# EAGLE board vr61-revC (EAGLE 9.6.2), part 1 of 2
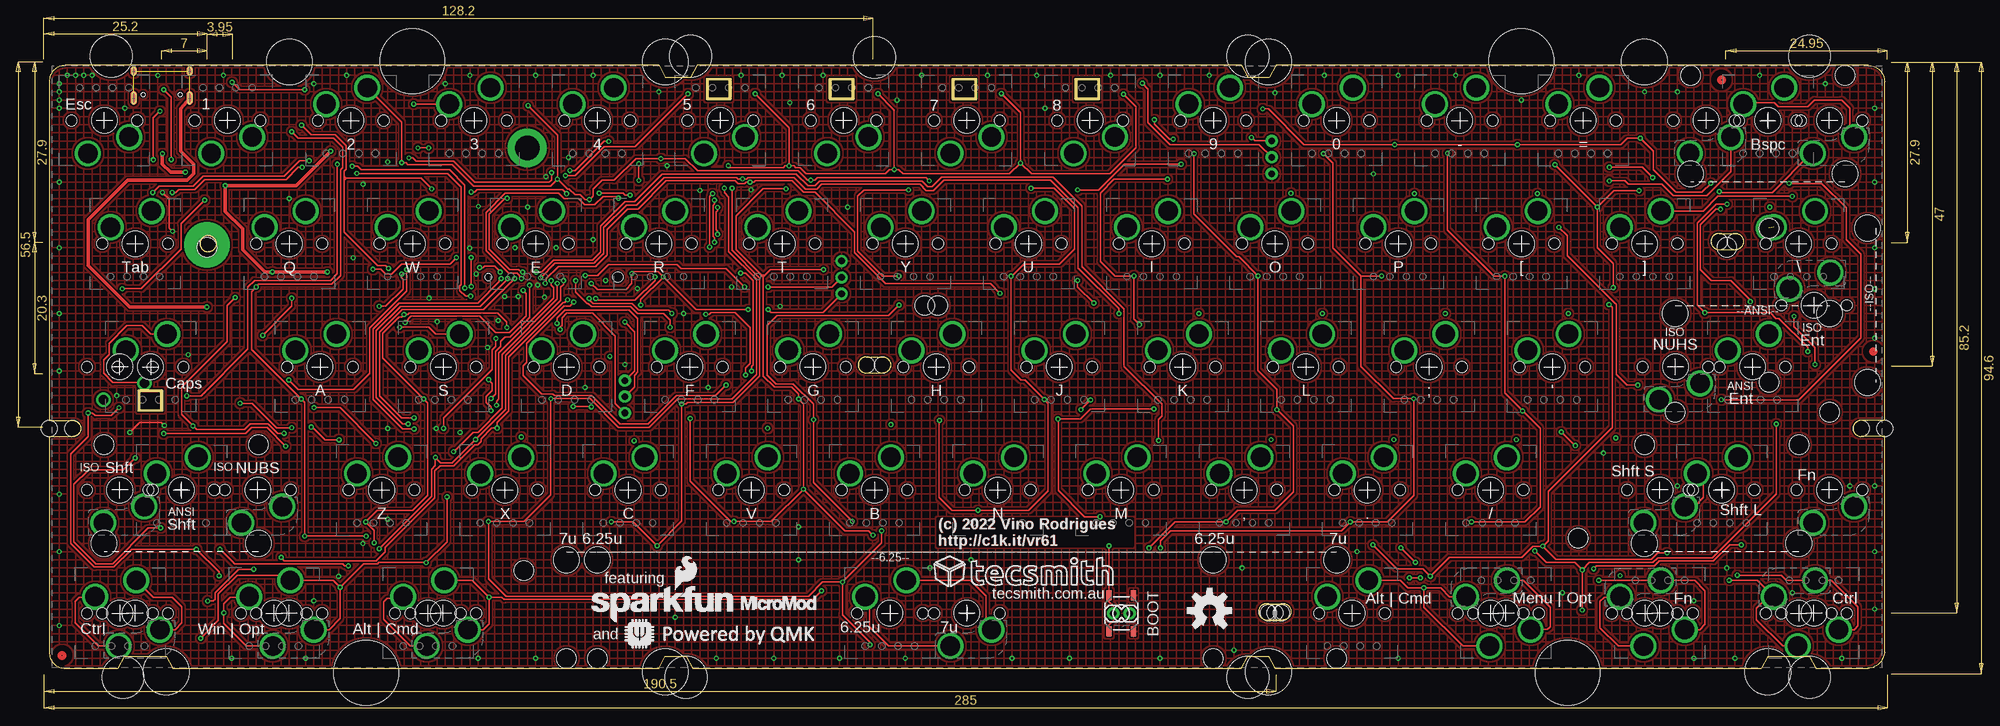
[diagram p2: board, top side]
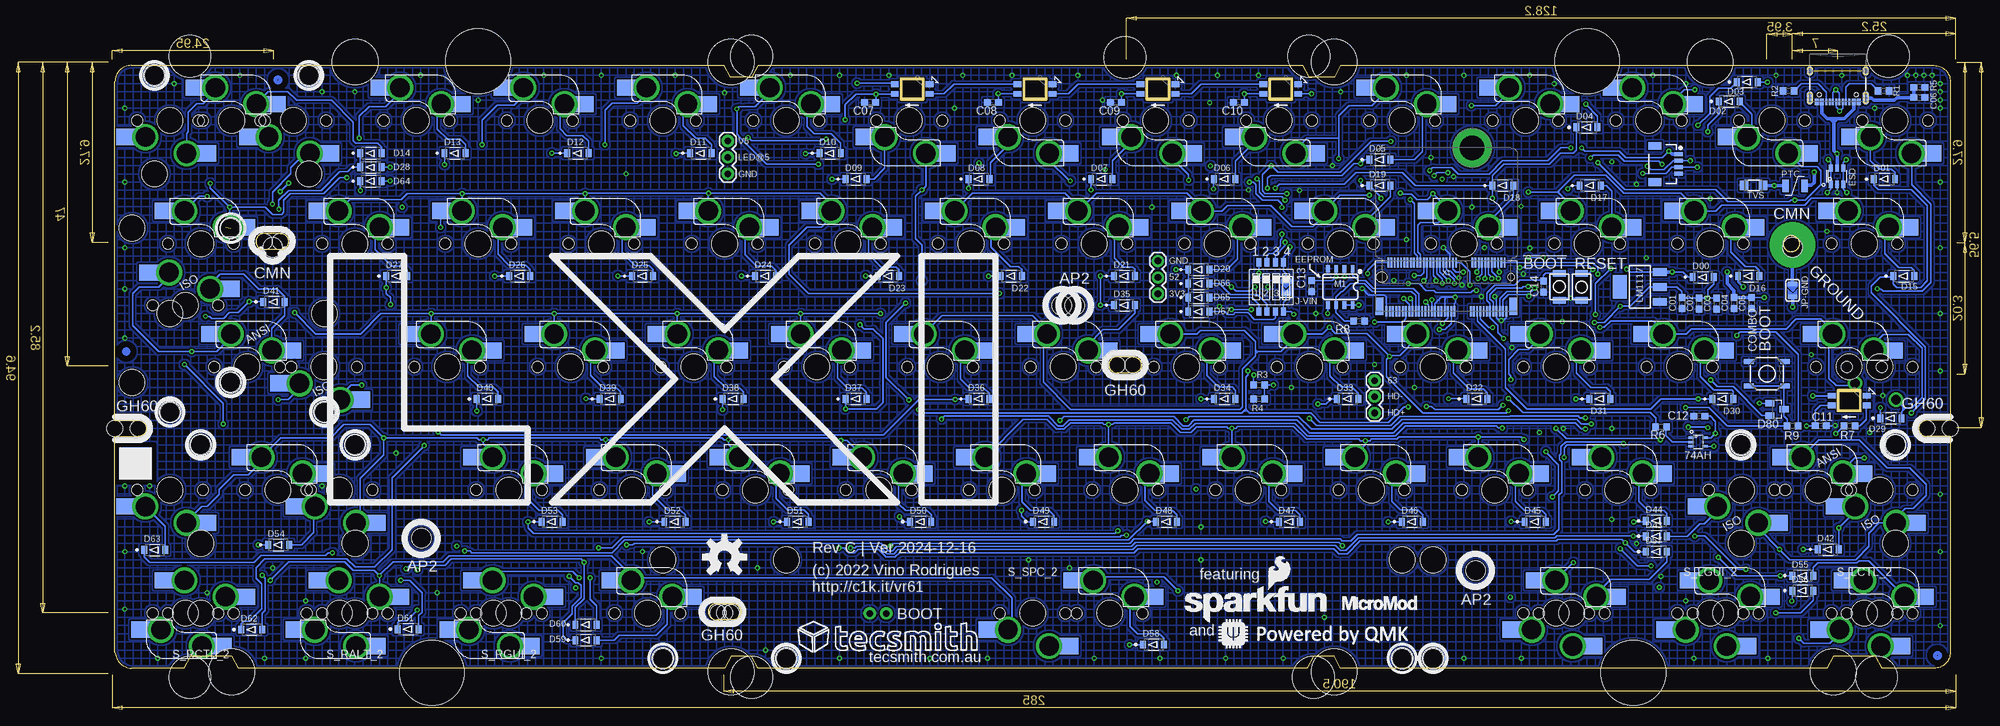
[diagram p3: board, bottom side, seen from below]

Size 304.13 x 107.25 mm. Coordinates in mm from the lower left corner, seen from the top.
Outline: 286.07,42.55 285.95,42.55
Outline: 131.41,54.55 arc180 131.46,52.05 133.95,52.05 arc180 133.94,54.55 131.41,54.55
Copper layers (1*16): Top 0.035mm / dielectric 1.5mm / Bottom 0.035mm
Design rules "jlcpcb *": minimum track width 5mil, minimum drill 0.3mm, track to track 9.5mil, track to pad 9.5mil, pad to pad 9.5mil, via to via 9.5mil, smd to smd 9.5mil, copper to edge 0.2mm, drill to drill 6mil, minimum pad ring 3mil, minimum via ring 8mil, stop-mask expansion 0mil, vias tented up to drill 15mil, thermal gap 10mil
Net classes: 0 default: width 0 mm, drill 0 mm
Holes 2.5 mm at 194.61,14.98 193.61,14.98 195.61,14.98

## Footprints (pad centres in the part's own frame; a part is rotated, then mirrored left to right if it is on the bottom)
SC-88A__TSSOP5__SOT353-1 = smd 0.375 x 0.825: 1 -0.65,-1.087; 2 0,-1.087; 3 0.65,-1.087; 4 0.65,1.087; 6 -0.65,1.087
0603 = smd 1.1 x 1: 1 -0.85,0; 2 0.85,0
C0603 = smd 1.1 x 1: 1 -0.85,0; 2 0.85,0
SOD-123 = smd 0.914 x 1.219: A 1.638,0; C -1.638,0
SOT23 = smd 1 x 1.4: 1 -0.95,-1.1; 2 0.95,-1.1; 3 0,1.1
DIP-1.27-004 = smd 0.76 x 1.27: 1 -1.905,-3.81; 2 -0.635,-3.81; 3 0.635,-3.81; 4 1.905,-3.81; 5 1.905,3.81; 6 0.635,3.81; 7 -0.635,3.81; 8 -1.905,3.81
SOT-23-6L = smd 0.6 x 1.1: P$1 -0.95,-1.25; P$2 0,-1.25; P$3 0.95,-1.25; P$4 0.95,1.25; P$5 0,1.25; P$6 -0.95,1.25
FOOTPRINT-AP2 = hole 3: 24,65; 73,15; 137,56; 236,20; 259,65; 135,56
STAND-OFF-REFLOW-M2.5 = drill 3.8 pad 6: 1 0,0
1X03 = drill 1.016 pad 1.88: 1 0,0; 2 2.54,0; 3 5.08,0
1X01 = drill 1.016 pad 1.88: 1 0,0
1X02 = drill 1.016 pad 1.88: 1 0,0; 2 2.54,0
USB-C-16P = smd 0.3 x 1: A5 -1.25,-0.34; A6 -0.25,-0.34; A7 0.25,-0.34; A8 1.25,-0.34; B5 1.75,-0.34; B6 0.75,-0.34; B7 -0.75,-0.34; B8 -1.75,-0.34 | smd 0.6 x 1: GND -3.225,-0.34; GND2 3.225,-0.34; VBUS1 -2.45,-0.34; VBUS2 2.45,-0.34 | smd 1 x 2.1: SHLD1 -4.32,-0.915; SHLD2 4.32,-0.915 | smd 1 x 2.1 bottom: SHLD3 -4.32,-0.915; SHLD4 4.32,-0.915 | smd 1 x 1.6: SHLD5 -4.32,-5.095; SHLD8 4.32,-5.095 | smd 1 x 1.6 bottom: SHLD6 -4.32,-5.095; SHLD7 4.32,-5.095 | hole 0.65: -2.89,-1.445; 2.89,-1.445
1X04_1MM_RA = smd 0.6 x 1.35: 1 -1.5,0; 2 -0.5,0; 3 0.5,0; 4 1.5,0 | smd 1.2 x 2: NC1 2.8,-3.675; NC2 -2.8,-3.675
SOLDERJUMPER_ARROW_NOPASTE = smd 0.762 x 1.524: 1 -1.016,0; 2 1.016,0
SK6812-E-MILL = smd 1.2 x 0.9 bottom: 1-VDD 2.7,-0.75; 2-DOUT 2.7,0.75; 3-GND -2.7,0.75; 4-DIN -2.7,-0.75
SOT223 = smd 1.219 x 2.235: 1 -2.311,-3.099; 2 0,-3.099; 3 2.311,-3.099 | smd 3.6 x 2.2: 4 0,3.099
8-SOIC = smd 0.6 x 1.2: 1 -1.905,-2.8; 2 -0.635,-2.8; 3 0.635,-2.8; 4 1.905,-2.8; 5 1.905,2.8; 6 0.635,2.8; 7 -0.635,2.8; 8 -1.905,2.8
SMD_PTC = smd 1 x 1.9: P$1 -1.5,0; P$2 1.5,0
R0603 = smd 1 x 1.1: 1 -0.85,0; 2 0.85,0
SKRKAEE020 = smd 1 x 2: 1 -2.1,0; 2 2.1,0
TACTILE_SWITCH_SMD_5.2MM = smd 1.524 x 0.762: 1 -2.794,1.905; 2 2.794,1.905; 3 -2.794,-1.905; 4 2.794,-1.905
MX-5-PIN-HOTSWAP-VIA = smd 3.15 x 2.5 bottom: 1@1 -6.785,2.54; 2@1 5.542,5.08 | drill 3 pad 3.75: 1@2 -3.81,2.54; 2@2 2.54,5.08 | hole 3.988: 0,0 | hole 1.7: -5.08,0; 5.08,0
MX-5-PIN-HOTSWAP-VIA-NS = smd 3.15 x 2.5 bottom: 1@1 -6.785,2.54; 2@1 5.542,5.08 | drill 3 pad 3.75: 1@2 -3.81,2.54; 2@2 2.54,5.08 | hole 3.988: 0,0 | hole 1.7: -5.08,0; 5.08,0
MX-5-PIN-MILMAX-3305-X-NS = drill 1.5: 1 -3.81,2.54; 2 2.54,5.08 | hole 3.988: 0,0 | hole 1.7: -5.08,0; 5.08,0
MX-STABS-200U = hole 3.988: -11.938,8.255; 11.938,8.255 | hole 3.048: -11.938,-6.985; 11.938,-6.985
MX-STABS-625U = hole 3.988: -50,8.255; 50,8.255 | hole 3.048: -50,-6.985; 50,-6.985
SOD123FL-BI = smd 1.3 x 1.4: P$1 -1.45,0; P$2 1.45,0
MX-STABS-700U = hole 3.988: -57.15,8.255; 57.15,8.255 | hole 3.048: -57.15,-6.985; 57.15,-6.985
FOOTPRINT-BAKENEKO60 = hole 6.5: 10.6,95.65; 100.14,95.65; 186.3,95.65; 273.15,95.65; 12.4,-0.4; 99.46,-0.41; 186.3,-0.4; 273.15,-0.4 | hole 7.11: 38.13,94.78; 96.25,94.78; 189.5,94.78; 247.62,94.78; 19.08,0.47; 96.25,0.47; 189.5,0.47; 266.68,0.47 | hole 10.04: 57.15,94.92; 228.6,94.92; 50.01,0.31; 235.74,0.31 | hole 6.47: 128.59,95.46 | hole 2.5: 4.616,38.1; 281.134,38.1; 25.575,66.675; 1,38.1; 284.75,38.1; 261.675,67.025; 259.175,67.025; 129.837,47.924; 127.337,47.924; 189.244,9.76; 191.744,9.76
M.2-CONNECTOR-E = smd 0.3 x 1.55: 1 9.25,-5.275; 2 9,2.275; 3 8.75,-5.275; 4 8.5,2.275; 5 8.25,-5.275; 6 8,2.275; 7 7.75,-5.275; 8 7.5,2.275; 9 7.25,-5.275; 10 7,2.275; 11 6.75,-5.275; 12 6.5,2.275; 13 6.25,-5.275; 14 6,2.275; 15 5.75,-5.275; 16 5.5,2.275; 17 5.25,-5.275; 18 5,2.275; 19 4.75,-5.275; 20 4.5,2.275; 21 4.25,-5.275; 22 4,2.275; 23 3.75,-5.275; 32 1.5,2.275; 33 1.25,-5.275; 34 1,2.275; 35 0.75,-5.275; 36 0.5,2.275; 37 0.25,-5.275; 38 0,2.275; 39 -0.25,-5.275; 40 -0.5,2.275; 41 -0.75,-5.275; 42 -1,2.275; 43 -1.25,-5.275; 44 -1.5,2.275; 45 -1.75,-5.275; 46 -2,2.275; 47 -2.25,-5.275; 48 -2.5,2.275; 49 -2.75,-5.275; 50 -3,2.275; 51 -3.25,-5.275; 52 -3.5,2.275; 53 -3.75,-5.275; 54 -4,2.275; 55 -4.25,-5.275; 56 -4.5,2.275; 57 -4.75,-5.275; 58 -5,2.275; 59 -5.25,-5.275; 60 -5.5,2.275; 61 -5.75,-5.275; 62 -6,2.275; 63 -6.25,-5.275; 64 -6.5,2.275; 65 -6.75,-5.275; 66 -7,2.275; 67 -7.25,-5.275; 68 -7.5,2.275; 69 -7.75,-5.275; 70 -8,2.275; 71 -8.25,-5.275; 72 -8.5,2.275; 73 -8.75,-5.275; 74 -9,2.275; 75 -9.25,-5.275 | smd 1.2 x 2.75: A1 10.35,-4.5; A2 -10.35,-4.5 | hole 1.1: 10,0 | hole 1.6: -10,0

## Placement (x,y rotation side)
74AH  74AHCT1G125GW  [SC-88A__TSSOP5__SOT353-1]  44.11,41.38 270 bottom
C01  100nF  [0603]  46.61,62.88 270 bottom
C02  22uF  [0603]  43.96,62.83 270 bottom
C03  4.7uF  [0603]  41.26,62.78 270 bottom
C04  100nF  [0603]  38.56,62.88 270 bottom
C05  22uF  [0603]  35.86,62.88 270 bottom
C06  4.7nF  [0603]  9.93,94.65 0 bottom
C07  100nF  [C0603]  172.11,93.88 180 bottom
C08  100nF  [C0603]  153.11,93.88 180 bottom
C09  100nF  [C0603]  134.11,93.88 180 bottom
C10  100nF  [C0603]  115.11,93.88 180 bottom
C11  100nF  [C0603]  25.11,43.88 0 bottom
C12  0.1uF  [C0603]  43.91,45.38 180 bottom
C13  100nF  [C0603]  103.81,65.48 270 bottom
C14  100nF  [C0603]  68.01,65.41 270 bottom
D00  B5819W SL  [SOD-123]  43.31,66.88 0 bottom
D01  [SOD-123]  15.29,82.05 0 bottom
D02  [SOD-123]  39.28,94.05 0 bottom
D03  [SOD-123]  36.5,97.05 0 bottom
D04  [SOD-123]  61.28,90.05 0 bottom
D05  [SOD-123]  93.28,85.05 0 bottom
D06  [SOD-123]  117.28,82.05 0 bottom
D07  [SOD-123]  136.29,82.05 0 bottom
D08  [SOD-123]  155.29,82.05 0 bottom
D09  [SOD-123]  174.29,82.05 0 bottom
D10  [SOD-123]  178.29,86.05 0 bottom
D11  [SOD-123]  198.29,86.05 0 bottom
D12  [SOD-123]  217.29,86.05 0 bottom
D13  [SOD-123]  236.29,86.05 0 bottom
D14  [SOD-123]  249.29,86.05 0 bottom
D15  [SOD-123]  12.29,67.05 0 bottom
D16  [SOD-123]  36.28,67.05 0 bottom
D17  [SOD-123]  60.78,81.05 0 bottom
D18  [SOD-123]  74.28,81.05 0 bottom
D19  [SOD-123]  93.28,81.05 0 bottom
D20  [SOD-123]  121.28,68.05 0 bottom
D21  [SOD-123]  132.79,67.05 0 bottom
D22  [SOD-123]  150.29,67.05 0 bottom
D23  [SOD-123]  169.29,67.05 0 bottom
D24  [SOD-123]  188.29,67.05 0 bottom
D25  [SOD-123]  207.29,67.05 0 bottom
D26  [SOD-123]  226.29,67.05 0 bottom
D27  [SOD-123]  245.29,67.05 0 bottom
D28  [SOD-123]  249.29,83.88 0 bottom
D29  [SOD-123]  14.29,45.05 0 bottom
D30  [SOD-123]  40.28,48.05 0 bottom
D31  [SOD-123]  59.28,48.05 0 bottom
D32  [SOD-123]  78.28,48.05 0 bottom
D33  [SOD-123]  98.28,48.05 0 bottom
D34  [SOD-123]  117.28,48.05 0 bottom
D35  [SOD-123]  132.79,62.55 0 bottom
D36  [SOD-123]  155.29,48.05 0 bottom
D37  [SOD-123]  174.29,48.05 0 bottom
D38  [SOD-123]  193.29,48.05 0 bottom
D39  [SOD-123]  212.29,48.05 0 bottom
D40  [SOD-123]  231.29,48.05 0 bottom
D41  [SOD-123]  264.29,63.05 0 bottom
D42  [SOD-123]  23.98,24.75 0 bottom
D43  [SOD-123]  50.54,26.81 0 bottom
D44  [SOD-123]  50.54,29.19 0 bottom
D45  [SOD-123]  69.28,29.05 0 bottom
D46  [SOD-123]  88.28,29.05 0 bottom
D47  [SOD-123]  107.28,29.05 0 bottom
D48  [SOD-123]  126.28,29.05 0 bottom
D49  [SOD-123]  145.29,29.05 0 bottom
D50  [SOD-123]  164.29,29.05 0 bottom
D51  [SOD-123]  183.29,29.05 0 bottom
D52  [SOD-123]  202.29,29.05 0 bottom
D53  [SOD-123]  221.29,29.05 0 bottom
D54  [SOD-123]  263.56,25.47 0 bottom
D55  [SOD-123]  27.91,20.7 0 bottom
D56  [SOD-123]  27.93,18.39 0 bottom
D57  [SOD-123]  50.54,24.43 0 bottom
D58  [SOD-123]  128.28,10.05 0 bottom
D59  [SOD-123]  216.04,10.74 0 bottom
D60  [SOD-123]  216.04,13.12 0 bottom
D61  [SOD-123]  243.52,12.44 0 bottom
D62  [SOD-123]  267.71,12.37 0 bottom
D63  [SOD-123]  282.71,24.68 0 bottom
D64  [SOD-123]  249.29,81.73 0 bottom
D65  [SOD-123]  121.28,63.71 0 bottom
D66  [SOD-123]  121.28,65.88 0 bottom
D67  [SOD-123]  121.28,61.55 0 bottom
D80  BAS70-05  [SOT23]  31.91,46.43 270 bottom
DIP-SW  DIP004  [DIP-1.27-004]  110.11,65.38 0 bottom
ESD  ESD_SRV05-4  [SOT-23-6L]  22.61,82.48 0 bottom
FP_AP2  FOOTPRINT-AP2  [FOOTPRINT-AP2]  5.49,6.5 0 top
H5  STAND-OFF-REFLOW2.5MM_TALL  [STAND-OFF-REFLOW-M2.5]  79.01,86.87 0 top
J-52  [1X03]  127.61,69.38 270 bottom
J-63  [1X01]  94.11,50.88 0 bottom
J-BOOT  [1X02]  169.61,14.88 0 top
J-HOST  [1X02]  94.11,45.88 90 bottom
J-LED  [1X03]  194.11,82.88 90 bottom
J-UBS  [USB-C-16P]  22.5,93.68 180 bottom
J-UDB  SM04B-SRSS-TB(LF)(SN)  [1X04_1MM_RA]  47.11,84.38 270 bottom
J-VIN  [SOLDERJUMPER_ARROW_NOPASTE]  107.81,65.36 270 bottom
JP-GND  G-OPT  [SOLDERJUMPER_ARROW_NOPASTE]  29.48,64.86 270 bottom
LED-5  SK6812-E-REVERSE  [SK6812-E-MILL]  108.61,95.98 0 top
LED-6  SK6812-E-REVERSE  [SK6812-E-MILL]  127.61,95.98 0 top
LED-7  SK6812-E-REVERSE  [SK6812-E-MILL]  146.61,95.98 0 top
LED-8  SK6812-E-REVERSE  [SK6812-E-MILL]  165.61,95.98 0 top
LED-CL  SK6812-E-REVERSE  [SK6812-E-MILL]  20.73,47.78 0 top
LM1117  AMS1117-3.3  [SOT223]  53.11,65.38 90 bottom
LOGO1  OSHW-LOGOL  [OSHW-LOGO-L]  184.51,15.28 0 top
LOGO2  OSHW-LOGOL  [OSHW-LOGO-L]  194.63,23.61 0 bottom
M1  M25C  [8-SOIC]  99.41,65.38 180 bottom
PTC  PTC_ASMD1206-150  [SMD_PTC]  29.11,80.98 180 bottom
R1  5.1K  [R0603]  15.41,95.68 0 bottom
R2  5.1K  [R0603]  30.11,95.68 180 bottom
R3  150K  [R0603]  111.96,50.18 180 bottom
R4  75K  [R0603]  111.96,48.05 0 bottom
R5  1000K  [0603]  9.91,96.24 180 bottom
R6  220  [R0603]  49.81,43.73 180 bottom
R7  470  [R0603]  20.71,43.88 180 bottom
R8  5.1K  [R0603]  96.51,60.08 180 bottom
R9  5.1K  [R0603]  29.46,43.88 0 bottom
S1  [SKRKAEE020]  62.11,65.38 90 bottom
S2  [SKRKAEE020]  65.56,65.41 90 bottom
S3  BOOT  [TACTILE_SWITCH_SMD_5.2MM]  33.45,51.94 0 bottom
S4  BOOT  [TACTILE_SWITCH_SMD_5.2MM]  170.86,14.88 270 top
S_0  MX-5-PIN-HOTSWAP-VIA  [MX-5-PIN-HOTSWAP-VIA]  204.14,91.1 0 top
S_1  MX-5-PIN-HOTSWAP-VIA  [MX-5-PIN-HOTSWAP-VIA]  32.69,91.1 180 top
S_2  MX-5-PIN-HOTSWAP-VIA  [MX-5-PIN-HOTSWAP-VIA]  51.73,91.1 0 top
S_3  MX-5-PIN-HOTSWAP-VIA  [MX-5-PIN-HOTSWAP-VIA]  70.78,91.1 0 top
S_4  MX-5-PIN-HOTSWAP-VIA  [MX-5-PIN-HOTSWAP-VIA]  89.83,91.1 0 top
S_5  MX-5-PIN-HOTSWAP-VIA  [MX-5-PIN-HOTSWAP-VIA]  108.89,91.1 180 top
S_6  MX-5-PIN-HOTSWAP-VIA  [MX-5-PIN-HOTSWAP-VIA]  127.94,91.1 180 top
S_7  MX-5-PIN-HOTSWAP-VIA  [MX-5-PIN-HOTSWAP-VIA]  146.99,91.1 180 top
S_8  MX-5-PIN-HOTSWAP-VIA  [MX-5-PIN-HOTSWAP-VIA]  166.04,91.1 180 top
S_9  MX-5-PIN-HOTSWAP-VIA  [MX-5-PIN-HOTSWAP-VIA]  185.09,91.1 0 top
S_A  MX-5-PIN-HOTSWAP-VIA  [MX-5-PIN-HOTSWAP-VIA]  46.97,53.01 0 top
S_APP  MX-5-PIN-HOTSWAP-VIA  [MX-5-PIN-HOTSWAP-VIA]  230.33,14.91 180 top
S_B  MX-5-PIN-HOTSWAP-VIA  [MX-5-PIN-HOTSWAP-VIA]  132.7,33.95 0 top
S_BSLS  MX-5-PIN-HOTSWAP-VIA  [MX-5-PIN-HOTSWAP-VIA]  275.57,72.05 0 top
S_BSLS2  MX-5-PIN-HOTSWAP-VIANO-SILK  [MX-5-PIN-HOTSWAP-VIA-NS]  256.52,53.01 180 top
S_BSPC  MX-5-PIN-HOTSWAP-VIA  [MX-5-PIN-HOTSWAP-VIA]  270.81,91.1 0 top
S_BSPC2  MX-5-PIN-HOTSWAP-VIANO-SILK  [MX-5-PIN-HOTSWAP-VIA-NS]  280.34,91.1 180 top
S_C  MX-5-PIN-HOTSWAP-VIA  [MX-5-PIN-HOTSWAP-VIA]  94.6,33.95 0 top
S_CAPS  MX-5-PIN-HOTSWAP-VIA  [MX-5-PIN-HOTSWAP-VIA]  20.78,53.01 0 top
S_CAPS2  MX-5-PIN-MILMAX-3305-XNO-SILK  [MX-5-PIN-MILMAX-3305-X-NS]  16.02,53.01 180 top
S_COM  MX-5-PIN-HOTSWAP-VIA  [MX-5-PIN-HOTSWAP-VIA]  189.85,33.95 0 top
S_D  MX-5-PIN-HOTSWAP-VIA  [MX-5-PIN-HOTSWAP-VIA]  85.07,53.01 0 top
S_DOT  MX-5-PIN-HOTSWAP-VIA  [MX-5-PIN-HOTSWAP-VIA]  208.9,33.95 0 top
S_E  MX-5-PIN-HOTSWAP-VIA  [MX-5-PIN-HOTSWAP-VIA]  80.31,72.05 0 top
S_ENT  MX-5-PIN-HOTSWAP-VIA  [MX-5-PIN-HOTSWAP-VIA]  268.43,53.01 0 top
S_ENT2  MX-5-PIN-HOTSWAP-VIANO-SILK  [MX-5-PIN-HOTSWAP-VIA-NS]  277.95,62.53 0 top
S_EQL  MX-5-PIN-HOTSWAP-VIA  [MX-5-PIN-HOTSWAP-VIA]  242.24,91.1 0 top
S_ESC  MX-5-PIN-HOTSWAP-VIA  [MX-5-PIN-HOTSWAP-VIA]  13.64,91.1 180 top
S_F  MX-5-PIN-HOTSWAP-VIA  [MX-5-PIN-HOTSWAP-VIA]  104.12,53.01 0 top
S_FN  MX-5-PIN-HOTSWAP-VIANO-SILK  [MX-5-PIN-HOTSWAP-VIA-NS]  280.34,33.95 180 top
S_FN1  MX-5-PIN-HOTSWAP-VIA  [MX-5-PIN-HOTSWAP-VIA]  206.52,14.91 0 top
S_G  MX-5-PIN-HOTSWAP-VIA  [MX-5-PIN-HOTSWAP-VIA]  123.17,53.01 0 top
S_H  MX-5-PIN-HOTSWAP-VIA  [MX-5-PIN-HOTSWAP-VIA]  142.22,53.01 0 top
S_I  MX-5-PIN-HOTSWAP-VIA  [MX-5-PIN-HOTSWAP-VIA]  175.56,72.05 0 top
S_J  MX-5-PIN-HOTSWAP-VIA  [MX-5-PIN-HOTSWAP-VIA]  161.27,53.01 0 top
S_K  MX-5-PIN-HOTSWAP-VIA  [MX-5-PIN-HOTSWAP-VIA]  180.32,53.01 0 top
S_L  MX-5-PIN-HOTSWAP-VIA  [MX-5-PIN-HOTSWAP-VIA]  199.37,53.01 0 top
S_LALT  MX-5-PIN-HOTSWAP-VIA  [MX-5-PIN-HOTSWAP-VIA]  63.64,14.91 0 top
S_LALT_2  MX-5-PIN-HOTSWAP-VIANO-SILK  [MX-5-PIN-HOTSWAP-VIA-NS]  66.02,14.91 180 top
S_LBRC  MX-5-PIN-HOTSWAP-VIA  [MX-5-PIN-HOTSWAP-VIA]  232.71,72.05 0 top
S_LCTL  MX-5-PIN-HOTSWAP-VIA  [MX-5-PIN-HOTSWAP-VIA]  16.02,14.91 0 top
S_LCTL_2  MX-5-PIN-HOTSWAP-VIANO-SILK  [MX-5-PIN-HOTSWAP-VIA-NS]  18.4,14.91 180 top
S_LGUI  MX-5-PIN-HOTSWAP-VIA  [MX-5-PIN-HOTSWAP-VIA]  39.83,14.91 0 top
S_LGUI_2  MX-5-PIN-HOTSWAP-VIANO-SILK  [MX-5-PIN-HOTSWAP-VIA-NS]  42.21,14.91 180 top
S_LSFT  MX-5-PIN-HOTSWAP-VIA  [MX-5-PIN-HOTSWAP-VIA]  25.54,33.95 0 top
S_LSFT2  MX-5-PIN-HOTSWAP-VIANO-SILK  [MX-5-PIN-HOTSWAP-VIA-NS]  16.02,33.95 180 top
S_M  MX-5-PIN-HOTSWAP-VIA  [MX-5-PIN-HOTSWAP-VIA]  170.8,33.95 0 top
S_MINS  MX-5-PIN-HOTSWAP-VIA  [MX-5-PIN-HOTSWAP-VIA]  223.19,91.1 0 top
S_N  MX-5-PIN-HOTSWAP-VIA  [MX-5-PIN-HOTSWAP-VIA]  151.75,33.95 0 top
S_NUBS  MX-5-PIN-HOTSWAP-VIANO-SILK  [MX-5-PIN-HOTSWAP-VIA-NS]  37.35,33.95 180 top
S_O  MX-5-PIN-HOTSWAP-VIA  [MX-5-PIN-HOTSWAP-VIA]  194.61,72.05 0 top
S_P  MX-5-PIN-HOTSWAP-VIA  [MX-5-PIN-HOTSWAP-VIA]  213.66,72.05 0 top
S_Q  MX-5-PIN-HOTSWAP-VIA  [MX-5-PIN-HOTSWAP-VIA]  42.21,72.05 0 top
S_QUOT  MX-5-PIN-HOTSWAP-VIA  [MX-5-PIN-HOTSWAP-VIA]  237.47,53.01 0 top
S_R  MX-5-PIN-HOTSWAP-VIA  [MX-5-PIN-HOTSWAP-VIA]  99.36,72.05 0 top
S_RALT  MX-5-PIN-HOTSWAP-VIA  [MX-5-PIN-HOTSWAP-VIA]  254.14,14.91 180 top
S_RALT_2  MX-5-PIN-HOTSWAP-VIANO-SILK  [MX-5-PIN-HOTSWAP-VIA-NS]  251.76,14.91 0 top
S_RBRC  MX-5-PIN-HOTSWAP-VIA  [MX-5-PIN-HOTSWAP-VIA]  251.76,72.05 0 top
S_RCTL  MX-5-PIN-HOTSWAP-VIA  [MX-5-PIN-HOTSWAP-VIA]  277.95,14.91 180 top
S_RCTL_2  MX-5-PIN-HOTSWAP-VIANO-SILK  [MX-5-PIN-HOTSWAP-VIA-NS]  275.57,14.91 0 top
S_RGUI_2  MX-5-PIN-HOTSWAP-VIANO-SILK  [MX-5-PIN-HOTSWAP-VIA-NS]  227.95,14.91 0 top
S_RSFT  MX-5-PIN-HOTSWAP-VIA  [MX-5-PIN-HOTSWAP-VIA]  263.67,33.95 0 top
S_RSFT2  MX-5-PIN-HOTSWAP-VIANO-SILK  [MX-5-PIN-HOTSWAP-VIA-NS]  254.14,33.95 180 top
S_S  MX-5-PIN-HOTSWAP-VIA  [MX-5-PIN-HOTSWAP-VIA]  66.02,53.01 0 top
S_SCLN  MX-5-PIN-HOTSWAP-VIA  [MX-5-PIN-HOTSWAP-VIA]  218.42,53.01 0 top
S_SLSH  MX-5-PIN-HOTSWAP-VIA  [MX-5-PIN-HOTSWAP-VIA]  227.95,33.95 0 top
S_SPARE  MX-5-PIN-HOTSWAP-VIANO-SILK  [MX-5-PIN-HOTSWAP-VIA-NS]  261.29,91.1 180 top
S_SPC  MX-5-PIN-HOTSWAP-VIA  [MX-5-PIN-HOTSWAP-VIA]  135.08,14.91 0 top
S_SPC_2  MX-5-PIN-HOTSWAP-VIANO-SILK  [MX-5-PIN-HOTSWAP-VIA-NS]  146.99,14.91 180 top
S_T  MX-5-PIN-HOTSWAP-VIA  [MX-5-PIN-HOTSWAP-VIA]  118.41,72.05 0 top
S_TAB  MX-5-PIN-HOTSWAP-VIA  [MX-5-PIN-HOTSWAP-VIA]  18.4,72.05 0 top
S_U  MX-5-PIN-HOTSWAP-VIA  [MX-5-PIN-HOTSWAP-VIA]  156.51,72.05 0 top
S_V  MX-5-PIN-HOTSWAP-VIA  [MX-5-PIN-HOTSWAP-VIA]  113.65,33.95 0 top
S_W  MX-5-PIN-HOTSWAP-VIA  [MX-5-PIN-HOTSWAP-VIA]  61.26,72.05 0 top
S_X  MX-5-PIN-HOTSWAP-VIA  [MX-5-PIN-HOTSWAP-VIA]  75.55,33.95 0 top
S_Y  MX-5-PIN-HOTSWAP-VIA  [MX-5-PIN-HOTSWAP-VIA]  137.46,72.05 0 top
S_Z  MX-5-PIN-HOTSWAP-VIA  [MX-5-PIN-HOTSWAP-VIA]  56.5,33.95 0 top
T_BSPC  MX-STABS-200U  [MX-STABS-200U]  270.81,91.1 180 top
T_ENT  MX-STABS-200U  [MX-STABS-200U]  268.43,53.01 0 top
T_ENT1  MX-STABS-200U  [MX-STABS-200U]  277.95,62.53 270 top
T_LSFT  MX-STABS-200U  [MX-STABS-200U]  25.54,33.95 180 top
T_RSFT  MX-STABS-200U  [MX-STABS-200U]  263.67,33.95 180 top
T_SPC  MX-STABS-625U  [MX-STABS-625U]  135.08,14.91 0 top
TVS  TVS_SMF9.0CA  [SOD123FL-BI]  35.51,81.08 180 bottom
U$3  MICROMOD-LOGO  [MICROMOD-LOGO]  112.11,15.38 0 top
U$5  SPARKFUN_LOGO0.2  [SFE_LOGO_NAME_FLAME_.2]  88.3,13.38 0 top
U$6  QMK_LOGO  [QMK_LOGO]  94,9.38 0 top
U$7  TECSMITH-LOGOLONG  [TECSMITH-NAME]  180.87,11.38 0 bottom
U$8  TECSMITH-LOGOLONG  [TECSMITH-NAME]  144.3,21.5 0 top
U$10  SPARKFUN_LOGO0.2  [SFE_LOGO_NAME_FLAME_.2]  124.11,13.38 0 bottom
U$12  QMK_LOGO  [QMK_LOGO]  118.31,9.38 0 bottom
U$13  MICROMOD-LOGO  [MICROMOD-LOGO]  99.11,15.38 0 bottom
U$14  MX-STABS-700U  [MX-STABS-700U]  146.99,14.91 0 top
U$20  FIDUCIAL  [FIDUCIAL]  7.11,8.38 0 top
U$21  FIDUCIAL  [FIDUCIAL]  263.63,97.38 0 top
U$22  FIDUCIAL  [FIDUCIAL]  287.11,55.38 0 top
U$24  FOOTPRINT-BAKENEKO60  [FOOTPRINT-BAKENEKO60]  4.11,5.38 0 top
U$26  ?  [JLC_ORDER_NUMBER_QR_5X5]  285.71,38.08 0 bottom
U$27  FOOTPRINT-DIMS-GH60  [FOOTPRINT-DIMS-GH60]  4.11,5.38 0 top
X1  MICROMOD-2222-C  [M.2-CONNECTOR-E]  83.01,66.88 0 bottom